# EAGLE design Current Sensor (EAGLE 9.6.2)
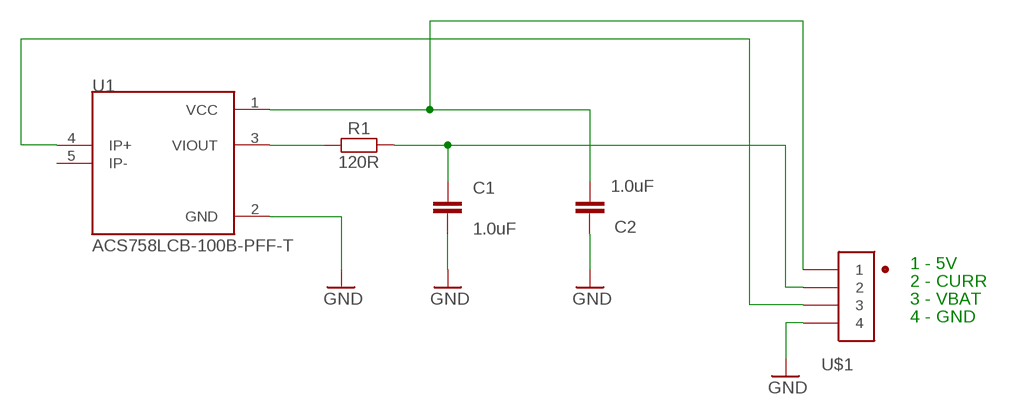
[diagram p0: schematic, sheet 1]

## Parts
C1  1.0uF  1.0UF-0603-16V-10%  [0603]
C2  1.0uF  1.0UF-0603-16V-10%  [0603]
R1  120R  RESISTOR0603  [0603]
U1  ACS758LCB-100B-PFF-T  [XDCR_ACS770KCB-150U-PFF-T]
U$1  JST-SH-4PINJST-SH-4-HORIZONTAL  [JST-SH-4PIN-1.0MM]

## Nets
GND: C1.2 C2.1 U1.2(GND) U$1.4
N$1: R1.1 U1.3(VIOUT)
N$2: C1.1 R1.2 U$1.2
N$3: U1.4(IP+) U$1.3
N$4: C2.2 U1.1(VCC) U$1.1
Unconnected: U1.5(IP-)

## Notes on the sheet
- 1 - 5V
- 2 - CURR
- 3 - VBAT
- 4 - GND

## Library data of the parts
C1 C2 = CodeWorks-Capacitors:1.0UF: 1µF ceramic capacitors A capacitor is a passive two-terminal electrical component used to store electrical energy temporarily in an electric field.; PROD_ID: CAP-00868
R1 = CodeWorks-Resistors:RESISTOR: Generic Resistor Package
U1 = CodeWorks-Modules:ACS758LCB-100B-PFF-T: Thermally Enhanced, Fully Integrated, Hall Effect-Based Linear Current Sensor IC with 100 micro-Ohms Current Conductor Check availability <https://pricing.snapeda.com/parts/ACS758LCB-100B-PFF-T/Allegro/view-part?ref=eda>; AVAILABILITY: In Stock; CHECK_PRICES: https://www.snapeda.com/parts/ACS758LCB-100B-PFF-T/Allegro+Industries/view-part/?ref=eda; DESCRIPTION: Current Sensor 100A 1 Channel Hall Effect, Open Loop Bidirectional 5-CB Formed Leads, PFF; MF: Allegro; MP: ACS758LCB-100B-PFF-T; PACKAGE: 5-CB-5 Allegro MicroSystems LLC; PRICE: None; PURCHASE-URL: https://www.snapeda.com/api/url_track_click_mouser/?unipart_id=87342&manufacturer=Allegro&part_name=ACS758LCB-100B-PFF-T&search_term=None; SNAPEDA_LINK: https://www.snapeda.com/parts/ACS758LCB-100B-PFF-T/Allegro+Industries/view-part/?ref=snap
U$1 = CodeWorks-Connectors:JST-SH-4PIN

## Board
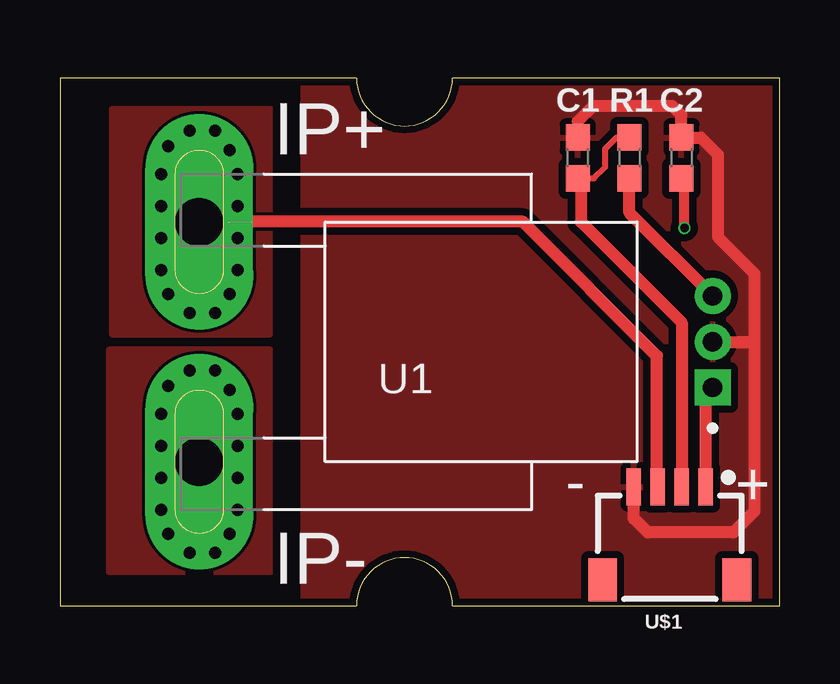
[diagram p1: board, top side]
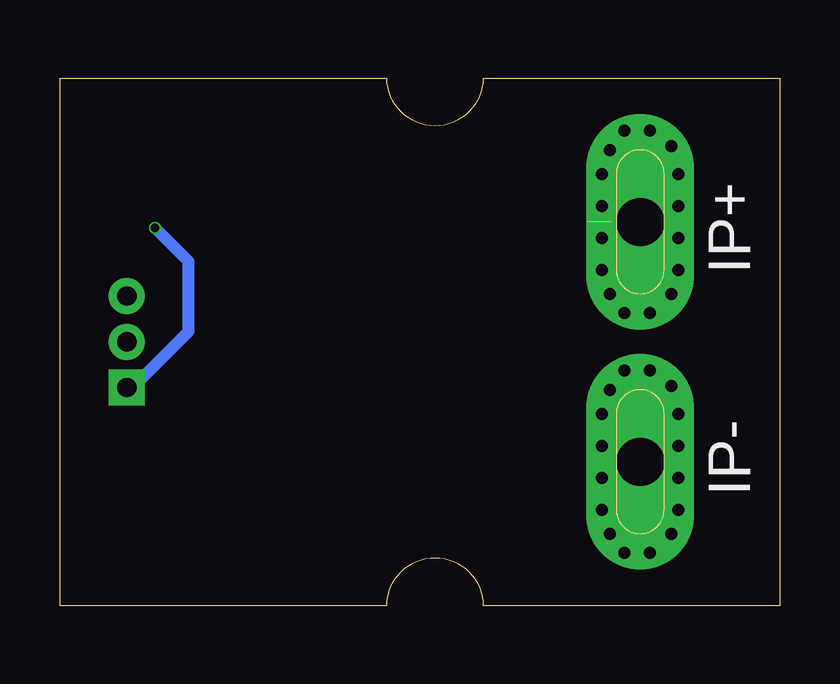
[diagram p2: board, bottom side, seen from below]

Size 30 x 22 mm. Coordinates in mm from the lower left corner, seen from the top.
Outline: 4.81,14 4.81,18 4.81,18.09 4.83,18.17 4.84,18.26 4.87,18.34 4.9,18.42 4.94,18.5 4.99,18.57 5.04,18.64 5.1,18.71 5.17,18.77 5.24,18.82 5.31,18.87 5.39,18.91 5.47,18.94 5.55,18.97 5.64,18.98 5.72,19 5.81,19 5.9,19 5.98,18.98 6.07,18.97 6.15,18.94 6.23,18.91 6.31,18.87 6.38,18.82 6.45,18.77 6.52,18.71 6.58,18.64 6.63,18.57 6.68,18.5 6.72,18.42 6.75,18.34 6.78,18.26 6.79,18.17 6.81,18.09 6.81,18 6.81,14 6.81,13.91 6.79,13.83 6.78,13.74 6.75,13.66 6.72,13.58 6.68,13.5 6.63,13.43 6.58,13.36 6.52,13.29 6.45,13.23 6.38,13.18 6.31,13.13 6.23,13.09 6.15,13.06 6.07,13.03 5.98,13.02 5.9,13 5.81,13 5.72,13 5.64,13.02 5.55,13.03 5.47,13.06 5.39,13.09 5.31,13.13 5.24,13.18 5.17,13.23 5.1,13.29 5.04,13.36 4.99,13.43 4.94,13.5 4.9,13.58 4.87,13.66 4.84,13.74 4.83,13.83 4.81,13.91 4.81,14
Outline: 4.81,4 4.81,8 4.81,8.09 4.83,8.17 4.84,8.26 4.87,8.34 4.9,8.42 4.94,8.5 4.99,8.57 5.04,8.64 5.1,8.71 5.17,8.77 5.24,8.82 5.31,8.87 5.39,8.91 5.47,8.94 5.55,8.97 5.64,8.98 5.72,9 5.81,9 5.9,9 5.98,8.98 6.07,8.97 6.15,8.94 6.23,8.91 6.31,8.87 6.38,8.82 6.45,8.77 6.52,8.71 6.58,8.64 6.63,8.57 6.68,8.5 6.72,8.42 6.75,8.34 6.78,8.26 6.79,8.17 6.81,8.09 6.81,8 6.81,4 6.81,3.91 6.79,3.83 6.78,3.74 6.75,3.66 6.72,3.58 6.68,3.5 6.63,3.43 6.58,3.36 6.52,3.29 6.45,3.23 6.38,3.18 6.31,3.13 6.23,3.09 6.15,3.06 6.07,3.03 5.98,3.02 5.9,3 5.81,3 5.72,3 5.64,3.02 5.55,3.03 5.47,3.06 5.39,3.09 5.31,3.13 5.24,3.18 5.17,3.23 5.1,3.29 5.04,3.36 4.99,3.43 4.94,3.5 4.9,3.58 4.87,3.66 4.84,3.74 4.83,3.83 4.81,3.91 4.81,4
Outline: 12.36,22 0,22 0,0 12.36,0 arc-180 16.36,0 30,0 30,22 16.36,22 arc-180 12.36,22
Copper layers (1*16): Top 0.035mm / dielectric 1.6mm / Bottom 0.035mm
Design rules "jlcpcb-2layers": minimum track width 5mil, minimum drill 0.3mm, track to track 5mil, track to pad 5mil, pad to pad 5mil, via to via 5mil, smd to smd 5mil, copper to edge 0.2mm, drill to drill 6mil, minimum pad ring 10mil, minimum via ring 3mil, stop-mask expansion 4mil, vias tented up to drill 0mil, thermal gap 10mil

### Footprints (pad centres in the part's own frame; a part is rotated, then mirrored left to right if it is on the bottom)
0603 = smd 1.1 x 1: 1 -0.85,0; 2 0.85,0
XDCR_ACS770KCB-150U-PFF-T = drill 0.8 pad 1.5 square: 1 -1.91,-10.7 | drill 0.8 pad 1.5: 2 0,-10.7; 3 1.91,-10.7 | drill 2 pad 4.5 long: 4 5,10.7; 5 -5,10.7 | drill 0.5 pad 0.8: 4_1 3,9.1; 4_2 4.33,9.1; 4_3 5.66,9.1; 4_4 6.99,9.1; 4_5 8,9.43; 4_6 8.8,10.05; 4_7 8.8,11.1; 4_8 8.15,12; 4_9 6.99,12.3; 4_10 5.66,12.3; 4_11 4.33,12.3; 4_12 3,12.3; 4_13 2,12; 4_14 1.2,11.1; 4_15 1.2,10.05; 4_16 2,9.43; 5_1 -7,9.1; 5_2 -5.67,9.1; 5_3 -4.34,9.1; 5_4 -3.01,9.1; 5_5 -8,9.43; 5_6 -8.8,10.05; 5_7 -8.8,11.1; 5_8 -8,12; 5_9 -7,12.3; 5_10 -5.67,12.3; 5_11 -4.34,12.3; 5_12 -3.01,12.3; 5_13 -1.85,12; 5_14 -1.2,11.1; 5_15 -1.2,10.05; 5_16 -2,9.43
JST-SH-4PIN-1.0MM = smd 0.6 x 1.55: 1 0,0; 2 1,0; 3 2,0; 4 3,0 | smd 1.2 x 1.8: M1 -1.3,3.875; M2 4.3,3.875

### Placement (x,y rotation side)
C1  21.59,18.67 90 top
C2  25.91,18.67 270 top
R1  23.75,18.67 90 top
U1  16.51,11 90 top
U$1  26.92,4.95 180 top

### Tracks (layer width: path | path; a pad name or v marks a point on that pad's centre or on a via)
A
  pour Top: 8.76,1.4 8.76,10.67 2.03,10.67 2.03,1.4
B
  pour Top: 2.16,11.3 8.76,11.3 8.76,20.7 2.16,20.7
GND
  Top 0.254: 21.59,20.19 C1.2
  Top 0.508: U1.2 28.96,11 | 21.59,20.19 22.23,20.83 25.53,20.83 25.91,20.45 C2.1 26.71,19.52 27.43,18.8 27.43,15.37 28.96,13.84 28.96,11 | U$1.4 23.92,3.63 24.51,3.05 28.07,3.05 28.96,3.94 28.96,11
  pour Top (isolate 0.305): 10.16,0.25 10.16,21.72 29.72,21.72 29.72,0.25
N$1
  Top 0.508: U1.3 23.75,16.37 R1.1
N$2
  Top 0.254: C1.1 22.26,17.82 22.73,18.29 22.73,19.05 23.2,19.52 R1.2
  Top 0.508: C1.1 21.72,17.69 21.72,16 25.92,11.79 U$1.2
N$3  (1 unrouted)
  Top 0.254: 6.96,16 U1.4 5.94,16.13 6.83,16.13
  Top 0.508: U$1.3 24.89,4.99 24.89,10.41 19.3,16 8,16
  Bottom 0.152: U1.4 7.03,16
  Bottom 0.254: 6.96,16 U1.4
N$4  (via drill 0.35)
  Top 0.254: 26.04,17.69 C2.2
  Top 0.406: v26.04,15.75 26.04,17.69
  Top 0.508: U$1.1 26.92,8.8 U1.1
  Bottom 0.254: U1.1 26.98,9.09
  Bottom 0.508: 26.98,9.09 24.64,11.43 24.64,14.35 v26.04,15.75

### Text on the board
tNames: IP+ | - | + | IP-
bNames: IP+ | IP-